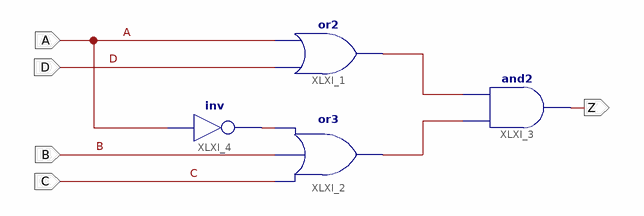
[diagram p0: schematic sheet 1]
// Xilinx ISE schematic ExamenP1ej1_v1.sch (spartan3) as structural Verilog: 4 symbols, 5 ports
module ExamenP1ej1_v1 (
  input  A,
  input  B,
  input  C,
  input  D,
  output Z
);

  wire XLXN_1, XLXN_2, XLXN_3;

  or XLXI_1 (XLXN_1, D, A);
  or XLXI_2 (XLXN_2, C, B, XLXN_3);
  and XLXI_3 (Z, XLXN_2, XLXN_1);
  not XLXI_4 (XLXN_3, A);
endmodule
